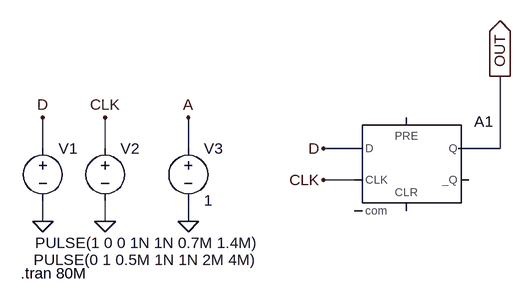
[diagram p0: schematic D_FLIPFLOP_WORK.asc]
D_FLIPFLOP_WORK.asc, the LTspice schematic file:
Version 4
SHEET 1 880 680
WIRE -48 96 -48 48
WIRE 48 96 48 48
WIRE 176 96 176 48
WIRE 432 96 384 96
WIRE 656 96 656 -16
WIRE 656 96 592 96
WIRE 432 144 384 144
WIRE -48 208 -48 176
WIRE 48 208 48 176
WIRE 176 208 176 176
FLAG -48 208 0
FLAG 48 208 0
FLAG 176 208 0
FLAG -48 48 D
FLAG 48 48 CLK
FLAG 176 48 A
FLAG 384 96 D
FLAG 384 144 CLK
FLAG 656 -16 OUT
IOPIN 656 -16 Out
SYMBOL voltage -48 80 R0
WINDOW 3 -12 161 Left 2
WINDOW 123 0 0 Left 0
WINDOW 39 0 0 Left 0
SYMATTR InstName V1
SYMATTR Value PULSE(1 0 0 1N 1N 0.7M 1.4M)
SYMBOL voltage 48 80 R0
WINDOW 3 -110 187 Left 2
WINDOW 123 0 0 Left 0
WINDOW 39 0 0 Left 0
SYMATTR InstName V2
SYMATTR Value PULSE(0 1 0.5M 1N 1N 2M 4M)
SYMBOL voltage 176 80 R0
WINDOW 123 0 0 Left 0
WINDOW 39 0 0 Left 0
SYMATTR InstName V3
SYMATTR Value 1
SYMBOL Digital\\dflop 512 48 R0
SYMATTR InstName A1
TEXT -82 288 Left 2 !.tran 80M

The netlist it stands for:
* D_FLIPFLOP_WORK.asc
V1 D 0 PULSE(1 0 0 1N 1N 0.7M 1.4M)
V2 CLK 0 PULSE(0 1 0.5M 1N 1N 2M 4M)
V3 A 0 1
A1 D 0 CLK 0 0 0 OUT 0 DFLOP
.tran 80M
.backanno
.end